# Altium schematic sheet RFFE_Controller.SchDoc
size A3
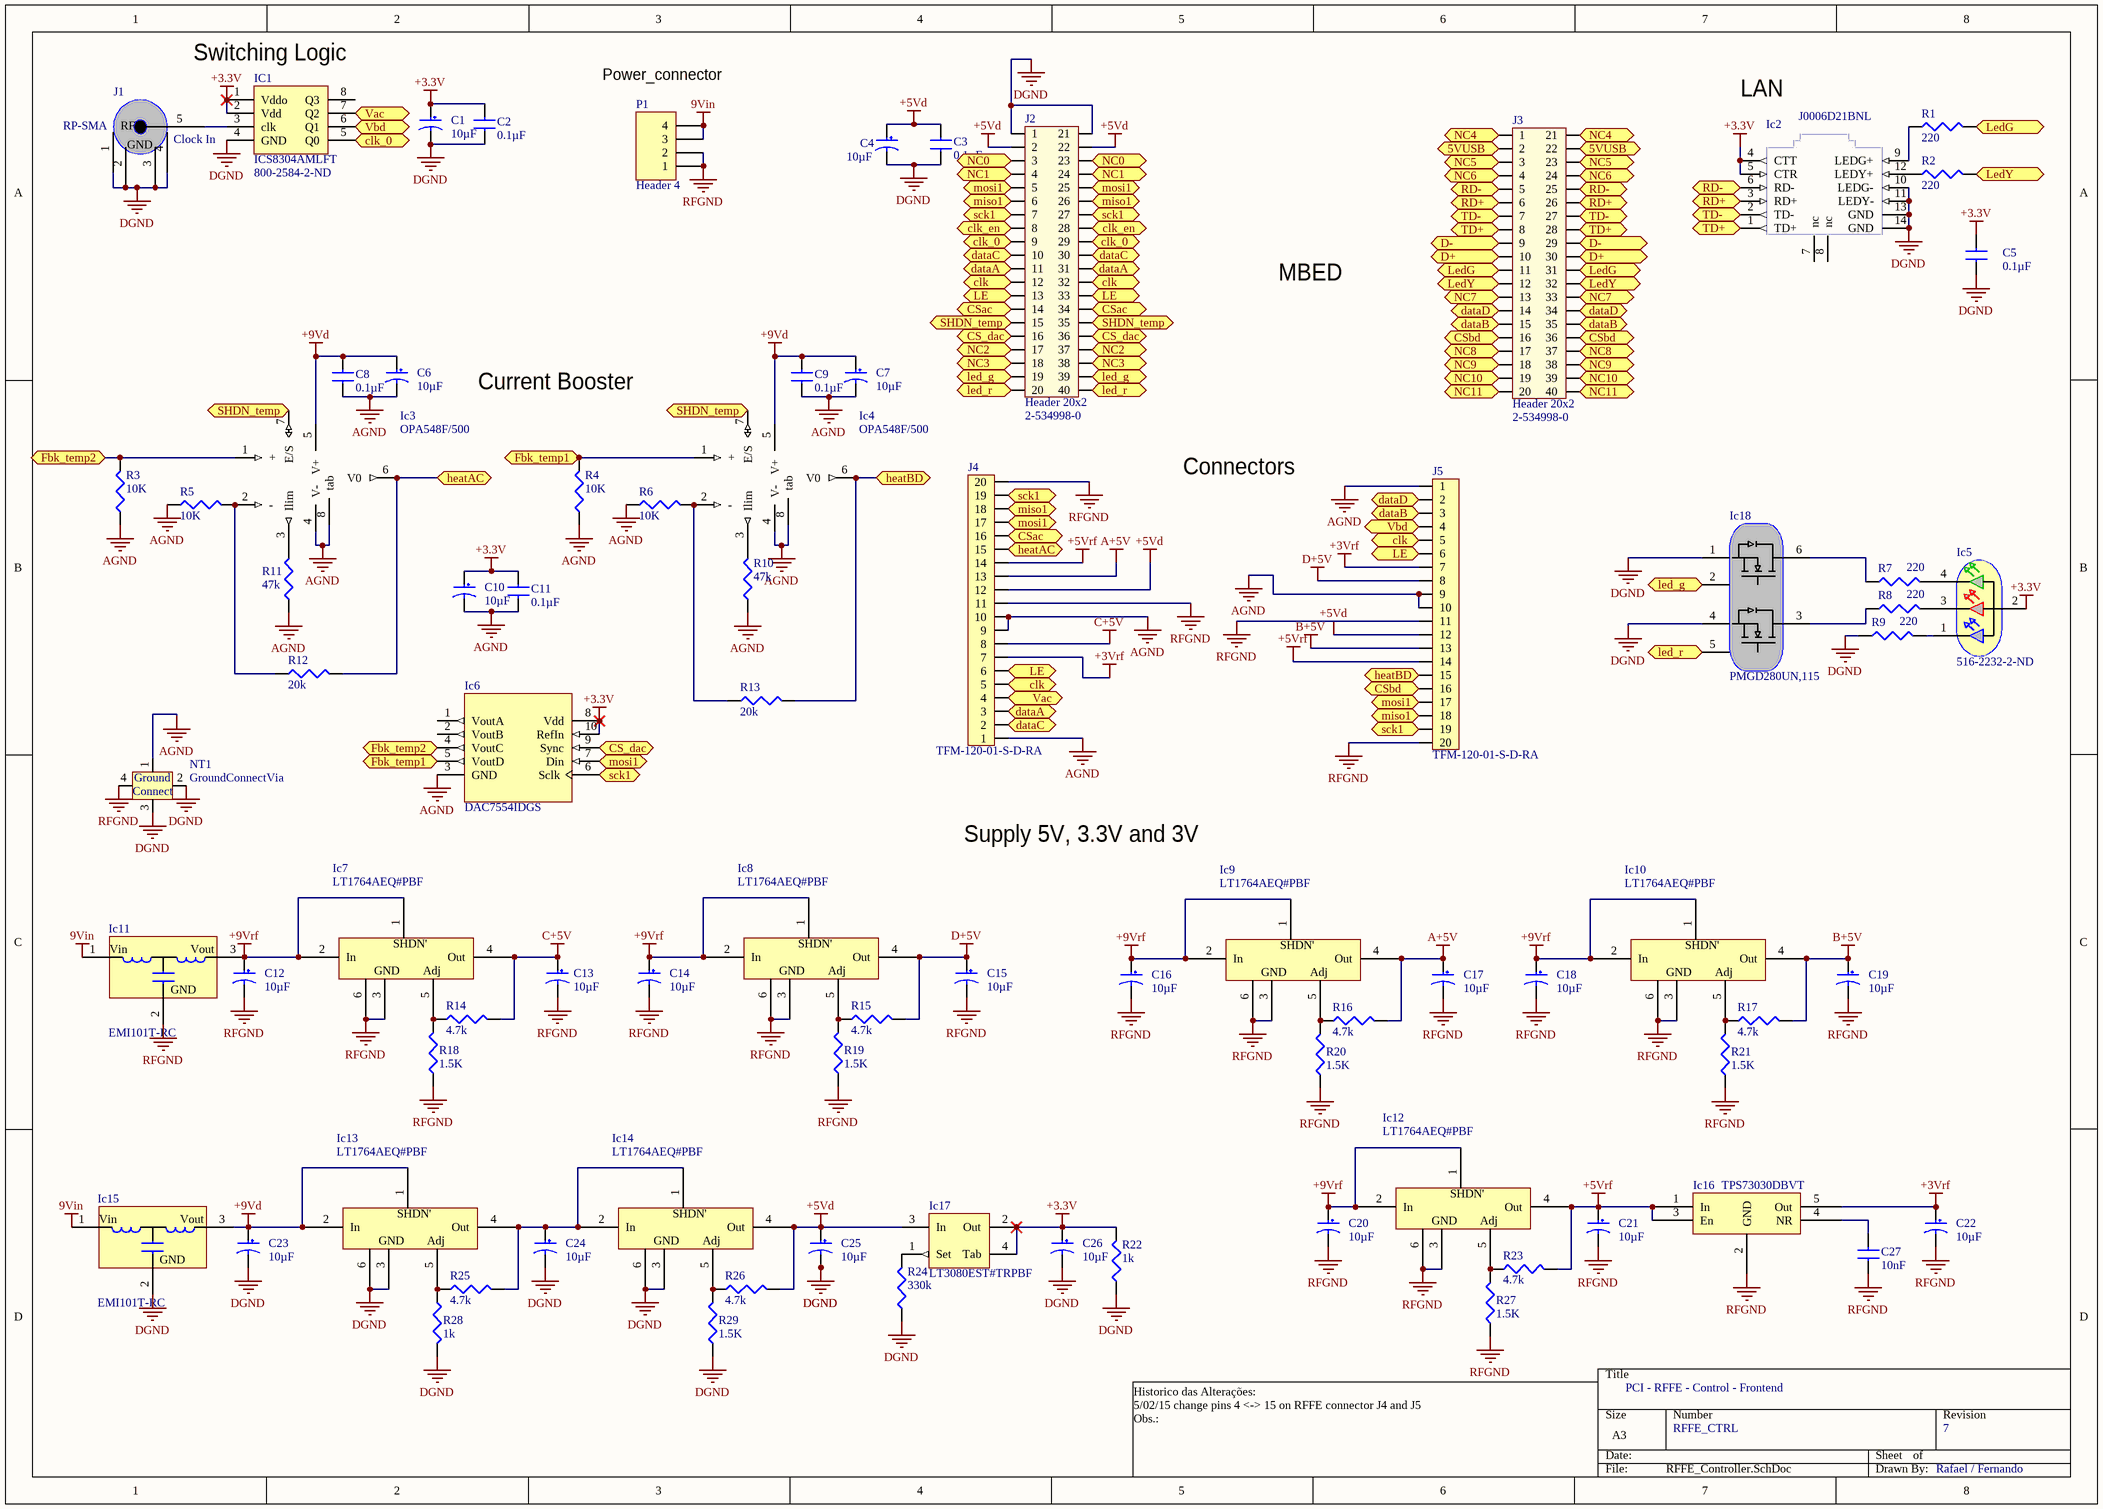
[diagram p0: RFFE_Controller.SchDoc]

## Parts
C1  Capacitance: 10µF  [1206]  (hidden comment: TPSA106K010R0900)
C2  Capacitance: 0.1µF  [0603]  (hidden comment: C1608X7R1E104K080AA)
C3  Capacitance: 0.1µF  [0603]  (hidden comment: C1608X7R1E104K080AA)
C4  Capacitance: 10µF  [1206]  (hidden comment: TPSA106K010R0900)
C5  Capacitance: 0.1µF  [0603]  (hidden comment: C1608X7R1E104K080AA)
C6  Capacitance: 10µF  [1206]  (hidden comment: TPSA106K010R0900)
C7  Capacitance: 10µF  [1206]  (hidden comment: TPSA106K010R0900)
C8  Capacitance: 0.1µF  [0603]  (hidden comment: C1608X7R1E104K080AA)
C9  Capacitance: 0.1µF  [0603]  (hidden comment: C1608X7R1E104K080AA)
C10  Capacitance: 10µF  [1206]  (hidden comment: TPSA106K010R0900)
C11  Capacitance: 0.1µF  [0603]  (hidden comment: C1608X7R1E104K080AA)
C12  Capacitance: 10µF  [1206]  (hidden comment: TPSA106K010R0900)
C13  Capacitance: 10µF  [0603]  (hidden comment: TPSA106K010R0900)
C14  Capacitance: 10µF  [1206]  (hidden comment: TPSA106K010R0900)
C15  Capacitance: 10µF  [0603]  (hidden comment: TPSA106K010R0900)
C16  Capacitance: 10µF  [1206]  (hidden comment: TPSA106K010R0900)
C17  Capacitance: 10µF  [0603]  (hidden comment: TPSA106K010R0900)
C18  Capacitance: 10µF  [1206]  (hidden comment: TPSA106K010R0900)
C19  Capacitance: 10µF  [0603]  (hidden comment: TPSA106K010R0900)
C20  Capacitance: 10µF  [1206]  (hidden comment: TPSA106K010R0900)
C21  Capacitance: 10µF  [0603]  (hidden comment: TPSA106K010R0900)
C22  Capacitance: 10µF  [TC3528-1411]  (hidden comment: CAP TANT 10UF)
C23  Capacitance: 10µF  [1206]  (hidden comment: TPSA106K010R0900)
C24  Capacitance: 10µF  [0603]  (hidden comment: TPSA106K010R0900)
C25  Capacitance: 10µF  [0603]  (hidden comment: TPSA106K010R0900)
C26  Capacitance: 10µF  [0603]  (hidden comment: TPSA106K010R0900)
C27  Capacitance: 10nF  [CAPC2012M]  (hidden comment: CAP CER 10000PF)
IC1  ICS8304AMLFT  Supplier Part Number 1: 800-2584-2-ND  [8-SOIC]
Ic2  J0006D21BNL  [RJ_45]
Ic3  Supplier Part Number 1: OPA548F/500  [DDPAK]  (hidden comment: OPA548FKTWT)
Ic4  Supplier Part Number 1: OPA548F/500  [DDPAK]  (hidden comment: OPA548FKTWT)
Ic5  Supplier Part Number 1: 516-2232-2-ND  [LED_3colors]  (hidden comment: HSMF-C113)
Ic6  DAC7554IDGS  [10-MSOP]
Ic7  IC LDO LO NOISE 3A ADJ DDPAK-5  [DD Pak]  (value not drawn)
Ic8  IC LDO LO NOISE 3A ADJ DDPAK-5  [DD Pak]  (value not drawn)
Ic9  IC LDO LO NOISE 3A ADJ DDPAK-5  [DD Pak]  (value not drawn)
Ic10  IC LDO LO NOISE 3A ADJ DDPAK-5  [DD Pak]  (value not drawn)
Ic11  EMI101T-RC  [Radial-3]
Ic12  IC LDO LO NOISE 3A ADJ DDPAK-5  [DD Pak]  (value not drawn)
Ic13  IC LDO LO NOISE 3A ADJ DDPAK-5  [DD Pak]  (value not drawn)
Ic14  IC LDO LO NOISE 3A ADJ DDPAK-5  [DD Pak]  (value not drawn)
Ic15  EMI101T-RC  [Radial-3]
Ic16  TPS73030DBVT  [DBV005]
Ic17  LT3080  [SOT-223]  (value not drawn)
Ic18  PMGD280UN,115  [SOT_363]
J1  Connector Style: RP-SMA  [SMAedge50R]  (hidden comment: CONN SMA)
J2  Header 20x2  [2-534998-0]
J3  Header 20x2  [2-534998-0]
J4  TFM-120-01-S-D-RA  [TFM-120-01-L-D]
J5  TFM-120-01-S-D-RA  [TFM-120-01-L-D]
NT1  GroundConnectVia  [GroundConnect]  (net tie, no BOM)
P1  Header 4  [HDR1X4]
R1  Resistance (Ohms): 220  [0603]  (hidden comment: ERJ-3GEYJ221V)
R2  Resistance (Ohms): 220  [0603]  (hidden comment: ERJ-3GEYJ221V)
R3  Resistance (Ohms): 10K  [RESC2012M]  (hidden comment: RES 10.0K)
R4  Resistance (Ohms): 10K  [RESC2012M]  (hidden comment: RES 10.0K)
R5  Resistance (Ohms): 10K  [RESC2012M]  (hidden comment: RES 10.0K)
R6  Resistance (Ohms): 10K  [RESC2012M]  (hidden comment: RES 10.0K)
R7  Resistance (Ohms): 220  [0603]  (hidden comment: ERJ-3GEYJ221V)
R8  Resistance (Ohms): 220  [0603]  (hidden comment: ERJ-3GEYJ221V)
R9  Resistance (Ohms): 220  [0603]  (hidden comment: ERJ-3GEYJ221V)
R10  Resistance (Ohms): 47k  [0603]  (hidden comment: ERJ-3GEYJ473V)
R11  Resistance (Ohms): 47k  [0603]  (hidden comment: ERJ-3GEYJ473V)
R12  20k  [0603]
R13  20k  [0603]
R14  Resistance (Ohms): 4.7k  [0603]  (hidden comment: ERJ-3GEYJ472V)
R15  Resistance (Ohms): 4.7k  [0603]  (hidden comment: ERJ-3GEYJ472V)
R16  Resistance (Ohms): 4.7k  [0603]  (hidden comment: ERJ-3GEYJ472V)
R17  Resistance (Ohms): 4.7k  [0603]  (hidden comment: ERJ-3GEYJ472V)
R18  Resistance (Ohms): 1.5K  [RESC2012M]  (hidden comment: RES 1.5K)
R19  Resistance (Ohms): 1.5K  [RESC2012M]  (hidden comment: RES 1.5K)
R20  Resistance (Ohms): 1.5K  [RESC2012M]  (hidden comment: RES 1.5K)
R21  Resistance (Ohms): 1.5K  [RESC2012M]  (hidden comment: RES 1.5K)
R22  Resistance (Ohms): 1k  [0603]  (hidden comment: ERJ-3EKF1001V)
R23  Resistance (Ohms): 4.7k  [0603]  (hidden comment: ERJ-3GEYJ472V)
R24  Resistance (Ohms): 330k  [0603]  (hidden comment: ERJ-3GEYJ334V)
R25  Resistance (Ohms): 4.7k  [0603]  (hidden comment: ERJ-3GEYJ472V)
R26  Resistance (Ohms): 4.7k  [0603]  (hidden comment: ERJ-3GEYJ472V)
R27  Resistance (Ohms): 1.5K  [RESC2012M]  (hidden comment: RES 1.5K)
R28  Resistance (Ohms): 1k  [0603]  (hidden comment: ERJ-3EKF1001V)
R29  Resistance (Ohms): 1.5K  [RESC2012M]  (hidden comment: RES 1.5K)

## Ports
5VUSB, clk, clk_0, clk_0 (out), clk_en, CS_dac (in), CS_dac (out), CSac, CSac (out), CSbd, CSbd (out), D+ (bidir), D- (bidir), dataA, dataB, dataC, dataD, Fbk_temp1, Fbk_temp2, heatAC, heatBD, LE, led_g (out), led_r (out), LedG, LedG (out), LedY, LedY (out), miso1, miso1 (out), mosi1, mosi1 (out), NC0 (out), NC1 (out), NC2 (out), NC3 (out), NC4 (out), NC5 (out), NC6 (out), NC7 (out), NC8 (out), NC9 (out), NC10 (out), NC11 (out), RD+, RD-, sck1, sck1 (out), SHDN_temp, TD+, TD-, Vac, Vac (out), Vbd, Vbd (out)

## Nets
9Vin: Ic11.1(Vin) Ic15.1(Vin) P1.3 P1.4
+3.3V: C1.1 C2.1 C5.1 C10.1 C11.1 C26.1 IC1.1(Vddo) IC1.2(Vdd) Ic2.4(CTT) Ic2.5(CTR) Ic5.2 Ic6.8(Vdd) Ic6.10(RefIn) Ic17.2(Out) Ic17.4(Tab) R22.1
+3Vrf: C22.1 Ic16.5(Out) J4.7 J5.7
+5Vd: C3.1 C4.1 C25.1 Ic14.4(Out) Ic17.3(In) J2.2 J2.22 J4.12 J5.12 R26.1
+5Vrf: C21.1 Ic12.4(Out) Ic16.1(In) Ic16.3(En) J4.14 J5.14 R23.1
+9Vd: C6.1 C7.1 C8.1 C9.1 C23.1 Ic3.5(V+) Ic4.5(V+) Ic13.1(SHDN) Ic13.2(In) Ic15.3(Vout)
+9Vrf: C12.1 C14.1 C16.1 C18.1 C20.1 Ic7.1(SHDN) Ic7.2(In) Ic8.1(SHDN) Ic8.2(In) Ic9.1(SHDN) Ic9.2(In) Ic10.1(SHDN) Ic10.2(In) Ic11.3(Vout) Ic12.1(SHDN) Ic12.2(In)
A+5V: C17.1 Ic9.4(Out) J4.13 R16.1
AGND: C6.2 C7.2 C8.2 C9.2 C10.2 C11.2 Ic3.4(V-) Ic3.8(tab) Ic4.4(V-) Ic4.8(tab) Ic6.3(GND) J4.1 J4.9 J4.10 J5.1 J5.9 J5.10 NT1.1 R3.2 R4.2 R5.2 R6.2 R10.2 R11.2
B+5V: C19.1 Ic10.4(Out) J5.13 R17.1
C+5V: C13.1 Ic7.4(Out) J4.8 R14.1
D+5V: C15.1 Ic8.4(Out) J5.8 R15.1
DGND: C1.2 C2.2 C3.2 C4.2 C5.2 C23.2 C24.2 C25.2 C26.2 IC1.4(GND) Ic2.10(LEDG-) Ic2.11(LEDY-) Ic2.13(GND) Ic2.14(GND) Ic13.3(GND) Ic13.6(GND) Ic14.3(GND) Ic14.6(GND) Ic15.2(GND) Ic18.1(S1) Ic18.4(S2) J1.1(GND) J1.2(GND) J1.3(GND) J1.4(GND) J2.1 J2.21 NT1.2 NT1.3 R9.2 R22.2 R24.2 R28.1 R29.2
RFGND: C12.2 C13.2 C14.2 C15.2 C16.2 C17.2 C18.2 C19.2 C20.2 C21.2 C22.2 C27.2 Ic7.3(GND) Ic7.6(GND) Ic8.3(GND) Ic8.6(GND) Ic9.3(GND) Ic9.6(GND) Ic10.3(GND) Ic10.6(GND) Ic11.2(GND) Ic12.3(GND) Ic12.6(GND) Ic16.2(GND) J4.11 J4.20 J5.11 J5.20 NT1.4 P1.1 P1.2 R18.2 R19.2 R20.2 R21.2 R27.2
5VUSB: J3.2 J3.22 ; port 5VUSB
clk: J2.12 J2.32 J4.5 J5.5 ; port clk
clk_0: IC1.5(Q0) J2.9 J2.29 ; port clk_0
clk_en: J2.8 J2.28 ; port clk_en
CS_dac: Ic6.9(Sync) J2.16 J2.36 ; port CS_dac
CSac: J2.14 J2.34 J4.16 ; port CSac
CSbd: J3.16 J3.36 J5.16 ; port CSbd
D+: J3.10 J3.30 ; port D+
D-: J3.9 J3.29 ; port D-
dataA: J2.11 J2.31 J4.3 ; port dataA
dataB: J3.15 J3.35 J5.3 ; port dataB
dataC: J2.10 J2.30 J4.2 ; port dataC
dataD: J3.14 J3.34 J5.2 ; port dataD
Fbk_temp1: Ic4.1(+) Ic6.5(VoutD) R4.1 ; port Fbk_temp1
Fbk_temp2: Ic3.1(+) Ic6.4(VoutC) R3.1 ; port Fbk_temp2
heatAC: Ic3.6(V0) J4.15 R12.1 ; port heatAC
heatBD: Ic4.6(V0) J5.15 R13.1 ; port heatBD
LE: J2.13 J2.33 J4.6 J5.6 ; port LE
led_g: Ic18.2(G1) J2.19 J2.39 ; port led_g
led_r: Ic18.5(G2) J2.20 J2.40 ; port led_r
LedG: J3.11 J3.31 R1.1 ; port LedG
LedY: J3.12 J3.32 R2.1 ; port LedY
miso1: J2.6 J2.26 J4.18 J5.18 ; port miso1
mosi1: Ic6.7(Din) J2.5 J2.25 J4.17 J5.17 ; port mosi1
NC0: J2.3 J2.23 ; port NC0
NC1: J2.4 J2.24 ; port NC1
NC2: J2.17 J2.37 ; port NC2
NC3: J2.18 J2.38 ; port NC3
NC4: J3.1 J3.21 ; port NC4
NC5: J3.3 J3.23 ; port NC5
NC6: J3.4 J3.24 ; port NC6
NC7: J3.13 J3.33 ; port NC7
NC8: J3.17 J3.37 ; port NC8
NC9: J3.18 J3.38 ; port NC9
NC10: J3.19 J3.39 ; port NC10
NC11: J3.20 J3.40 ; port NC11
RD+: Ic2.3(RD+) J3.6 J3.26 ; port RD+
RD-: Ic2.6(RD-) J3.5 J3.25 ; port RD-
sck1: Ic6.6(Sclk) J2.7 J2.27 J4.19 J5.19 ; port sck1
SHDN_temp: Ic3.7(E/S) Ic4.7(E/S) J2.15 J2.35 ; port SHDN_temp
TD+: Ic2.1(TD+) J3.8 J3.28 ; port TD+
TD-: Ic2.2(TD-) J3.7 J3.27 ; port TD-
Vac: IC1.7(Q2) J4.4 ; port Vac
Vbd: IC1.6(Q1) J5.4 ; port Vbd
NetC24_1: C24.1 Ic13.4(Out) Ic14.1(SHDN) Ic14.2(In) R25.1
NetC27_1: C27.1 Ic16.4(NR)
NetIC1_3: IC1.3(clk) J1.5(RFin)
NetIc2_9: Ic2.9(LEDG+) R1.2
NetIc2_12: Ic2.12(LEDY+) R2.2
NetIc3_2: Ic3.2(-) R5.1 R12.2
NetIc3_3: Ic3.3(Ilim) R11.1
NetIc4_2: Ic4.2(-) R6.1 R13.2
NetIc4_3: Ic4.3(Ilim) R10.1
NetIc5_1: Ic5.1 R9.1
NetIc5_3: Ic5.3 R8.1
NetIc5_4: Ic5.4 R7.1
NetIc7_5: Ic7.5(Adj) R14.2 R18.1
NetIc8_5: Ic8.5(Adj) R15.2 R19.1
NetIc9_5: Ic9.5(Adj) R16.2 R20.1
NetIc10_5: Ic10.5(Adj) R17.2 R21.1
NetIc12_5: Ic12.5(Adj) R23.2 R27.1
NetIc13_5: Ic13.5(Adj) R25.2 R28.2
NetIc14_5: Ic14.5(Adj) R26.2 R29.1
NetIc17_1: Ic17.1(Set) R24.1
NetIc18_3: Ic18.3(D2) R8.2
NetIc18_6: Ic18.6(D1) R7.2

Not connected (* = marked no-connect by the designer): IC1 8(Q3); Ic2 7(nc) 8(nc); Ic6 1(VoutA) 2(VoutB)

## Notes on the sheet
- (near IC1) Switching Logic
- (near P1) Power_connector
- LAN
- (near J1) Clock In
- MBED
- Current Booster
- Connectors
- Supply 5V, 3.3V and 3V
- PCI - RFFE - Control - Frontend
- RFFE_CTRL
- 7
- Historico das Alterações:
  5/02/15 change pins 4 <-> 15 on RFFE connector J4 and J5
  Obs.:
- Rafael / Fernando
- (in symbol 132289RP) RF
- (in symbol GroundConnectVia) Ground; Connect
- (in symbol LT1764AEQ#PBF) SHDN'

## Library data of the parts
C1 C4 C6 C7 C10 C12-C21 C23-C26 = TPSA106K010R0900: CAP TANT 10UF 10V 10% 1206; Manufacturer: AVX Corporation; Manufacturer Size Code: A; ESR (Equivalent Series Resistance): 900 mOhm; Type: Molded; Supplier 1: Digi-Key; Manufacturer Part Number: TPSA106K010R0900; RoHS: RoHS Compliant; Category: Capacitors; Stock 1: 24588; Pricing 1: 1=0.77, 10=0.737, 100=0.3575, 250=0.297, 500=0.2695, 1000=0.2475 (USD); Packaging: Cut Tape (CT); Voltage - Rated: 10V; Tolerance: ±10%; Operating Temperature: -55°C ~ 125°C; Mounting Type: Surface Mount; Package / Case: 1206 (3216 Metric); Size / Dimension: 0.126" L x 0.063" W (3.20mm x 1.60mm); Height - Seated (Max): 0.071" (1.80mm); Lead Spacing: -; Features: General Purpose; Lifetime @ Temp.: -; ComponentLink1URL: http://www.avx.com/docs/Catalogs/tps.pdf; ComponentLink1Description: http://www.avx.com/docs/Catalogs/tps.pdf; Supplier Part Number 1: 478-1751-1-ND
C2 C3 C5 C8 C9 C11 = C1608X7R1E104K080AA: CAP CER 0.1UF 25V 10% X7R 0603; Manufacturer: TDK Corporation; Supplier 1: Digi-Key; Manufacturer Part Number: C1608X7R1E104K080AA; RoHS: RoHS Compliant; Category: Capacitors; Stock 1: 128000; Pricing 1: 4000=0.0046, 8000=0.0042, 12000=0.004, 28000=0.0038, 100000=0.00275 (USD); Packaging: Tape & Reel (TR); Voltage - Rated: 25V; Tolerance: ±10%; Temperature Coefficient: X7R; Mounting Type: Surface Mount, MLCC; Operating Temperature: -55°C ~ 125°C; Applications: General Purpose; Ratings: -; Package / Case: 0603 (1608 Metric); Size / Dimension: 0.063" L x 0.031" W (1.60mm x 0.80mm); Height - Seated (Max): -; Thickness (Max): 0.037" (0.95mm); Lead Spacing: -; Features: -; Lead Style: -; ComponentLink1URL: http://product.tdk.com/capacitor/mlcc/en/documents/mlcc_commercial_general_en.pdf; ComponentLink1Description: http://product.tdk.com/capacitor/mlcc/en/documents/mlcc_commercial_general_en.pdf; Supplier Part Number 1: 445-1316-2-ND
C22 = T520B106M016ATE100: CAP TANT 10UF 16V 20% 1411; Manufacturer: Kemet; Manufacturer Size Code: B; ESR (Equivalent Series Resistance): 100.0 mOhm; Type: Molded; Supplier 1: Digi-Key; Manufacturer Part Number: T520B106M016ATE100; RoHS: RoHS Compliant; Category: Capacitors; Stock 1: 209; Pricing 1: 1=1.5, 10=1.23, 25=1.11, 100=0.99, 250=0.87, 500=0.81, 1000=0.63 (USD); Voltage - Rated: 16V; Tolerance: ±20%; Operating Temperature: -55°C ~ 105°C; Mounting Type: Surface Mount; Package / Case: 1411 (3528 Metric); Size / Dimension: 0.138" L x 0.110" W (3.50mm x 2.80mm); Height - Seated (Max): 0.083" (2.10mm); Lead Spacing: -; Features: Polymer; Packaging: Cut Tape (CT); Lifetime @ Temp.: -; ComponentLink1URL: http://www.kemet.com/datasheets&T520B106M016ATE100; ComponentLink1Description: http://www.kemet.com/datasheets&T520B106M016ATE100; Supplier Part Number 1: 399-5483-1-ND
C27 = C2012C0G1H103J/0.60: CAP CER 10000PF 50V 5% NP0 0805; Manufacturer: TDK Corporation; Temperature Coefficient: C0G, NP0; Supplier 1: Digi-Key; Manufacturer Part Number: C2012C0G1H103J/0.60; RoHS: RoHS Compliant; Category: Capacitors; Stock 1: 7053; Pricing 1: 1=0.46, 10=0.363, 100=0.1898, 250=0.14024, 500=0.1089, 1000=0.0858 (USD); Voltage - Rated: 50V; Tolerance: ±5%; Mounting Type: Surface Mount, MLCC; Operating Temperature: -55°C ~ 125°C; Applications: General Purpose; Ratings: -; Package / Case: 0805 (2012 Metric); Size / Dimension: 0.079" L x 0.049" W (2.00mm x 1.25mm); Height - Seated (Max): -; Thickness (Max): 0.028" (0.70mm); Lead Spacing: -; Features: -; Packaging: Cut Tape (CT); Lead Style: -; ComponentLink1URL: http://www.tdk.com/pdf/general_B11.pdf; ComponentLink1Description: http://www.tdk.com/pdf/general_B11.pdf; Supplier Part Number 1: 445-7519-1-ND
IC1 = ICS8304AMLFT: IC CLK BUFFER 1:4 200MHZ 8SOIC; Manufacturer: IDT, Integrated Device Technology Inc; Number of Circuits: 1; Differential - Input:Output: No/No; Input: LVCMOS, LVTTL; Voltage - Supply: 3.135 V ~ 3.465 V; Supplier 1: Digi-Key; Manufacturer Part Number: ICS8304AMLFT; RoHS: RoHS Compliant; Category: Integrated Circuits (ICs); Stock 1: 2500; Pricing 1: 2500=6.50278, 5000=6.29957, 12500=6.09636 (USD); Packaging: Tape & Reel (TR); Type: Fanout Buffer (Distribution); Ratio - Input:Output: 1:4; Output: LVCMOS, LVTTL; Frequency - Max: 200MHz; Operating Temperature: 0°C ~ 70°C; Mounting Type: Surface Mount; Package / Case: 8-SOIC (0.154", 3.90mm Width); Supplier Device Package: 8-SOIC; ComponentLink1URL: http://www.idt.com/document/8304-datasheet-0; ComponentLink1Description: http://www.idt.com/document/8304-datasheet-0
Ic2 = J0006D21BNL: CONN MAGJACK 1PORT 100 BASE-TX; Manufacturer: Pulse Electronics Corporation; Connector Type: RJ45; Number of Ports: 1; LED Color: Green - Yellow; Number of Cores per Jack: 4; Shielding: Shielded; Tab Direction: Down; Shield Material: Brass; Supplier 1: Digi-Key; Manufacturer Part Number: J0006D21BNL; RoHS: RoHS Compliant; Category: Connectors, Interconnects; Stock 1: 1565; Pricing 1: 1=6.38, 25=5.586, 50=5.32, 100=5.054, 250=4.522, 500=4.256, 1000=3.724, 2500=3.5378, 5000=3.458 (USD); Packaging: Bulk; Number of Rows: 1; Applications: 10/100 Base-TX, AutoMDIX; Mounting Type: Through Hole; Orientation: 90° Angle (Right); Termination: Solder; Height Above Board: 0.545" (13.84mm); Features: Board Guide; Contact Material: Phosphor Bronze; Contact Finish: Gold; Contact Finish Thickness: 15µin (0.38µm); Housing Material: Thermoplastic; Operating Temperature: 0°C ~ 70°C; ComponentLink1URL: http://productfinder.pulseeng.com/products/datasheets/J403.pdf; ComponentLink1Description: http://productfinder.pulseeng.com/products/datasheets/J403.pdf; Supplier Part Number 1: J0006D21BNL
Ic3 Ic4 = OPA548FKTWT: IC OPAMP PWR 1MHZ SGL D2PAK-7; Manufacturer: Texas Instruments; Amplifier Type: Power; Number of Circuits: 1; Slew Rate: 10 V/µs; Current - Input Bias: 100nA; Voltage - Input Offset: 2mV; Current - Supply: 17mA; Current - Output / Channel: 5A; Voltage - Supply, Single/Dual (±): 8 V ~ 60 V, ±4 V ~ 30 V; Supplier 1: Digi-Key; Manufacturer Part Number: OPA548FKTWT; RoHS: RoHS Compliant; Category: Integrated Circuits (ICs); Stock 1: 1164; Pricing 1: 1=16.22, 10=14.721, 25=13.6488 (USD); Packaging: Digi-Reel®; Output Type: -; Gain Bandwidth Product: 1MHz; -3db Bandwidth: -; Operating Temperature: -40°C ~ 85°C; Mounting Type: Surface Mount; Package / Case: TO-263-8, D²Pak (7 Leads + Tab), TO-263CA; Supplier Device Package: DDPAK/TO-263-7; ComponentLink1URL: http://www.ti.com/lit/ds/symlink/opa548.pdf; ComponentLink1Description: http://www.ti.com/lit/ds/symlink/opa548.pdf
Ic5 = HSMF-C113: LED CHIP RGB 2.5X1.0X1.0MM SMD; Manufacturer: Avago Technologies US Inc.; Wavelength - Dominant: 626nm, 572nm, 470nm; Wavelength - Peak: 637nm, 570nm, 468nm; Millicandela Rating: 80mcd Red, 50mcd Green, 60mcd Blue; Voltage - Forward (Vf) (Typ): 1.9V Red, 2V Green, 3.4V Blue; Current - Test: 20mA; Viewing Angle: 120°, 125°, 125°; Lens Type: Diffused; Lens Style/Size: Rectangle with Domed Top, 2.1mm x 1mm; Supplier 1: Digi-Key; Manufacturer Part Number: HSMF-C113; RoHS: RoHS Compliant; Category: Optoelectronics; Stock 1: 18000; Pricing 1: 3000=0.399, 6000=0.39, 15000=0.375, 30000=0.36 (USD); Packaging: Tape & Reel (TR); Color: Red, Green, Blue (RGB); Package / Case: 4-SMD, No Lead; Size / Dimension: 2.50mm L x 1.00mm W; Height: 1.00mm; Mounting Type: Surface Mount, Right Angle; Luminous Flux @ Current - Test: -; ComponentLink1URL: http://www.avagotech.com/docs/AV02-0611EN; ComponentLink1Description: http://www.avagotech.com/docs/AV02-0611EN
Ic6 = DAC7554IDGS: IC DAC 12BIT QUAD W/SPI 10-MSOP; Manufacturer: Texas Instruments; Settling Time: 5µs; Number of Bits: 12; Data Interface: Serial, SPI™; Number of Converters: 4; Voltage Supply Source: Single Supply; Power Dissipation (Max): 3.5mW; Number of Outputs and Type: 4 Voltage, Unipolar; DAC7554: 296-17551-5-ND; Supplier 1: Digi-Key; RoHS: RoHS Compliant; Category: Integrated Circuits (ICs); Stock 1: 1057; Pricing 1: 1=11.48, 10=10.44, 100=7.047, 250=6.91652, 500=6.786, 750=6.65551, 1000=6.525 (USD); Packaging: Tube; Operating Temperature: -40°C ~ 105°C; Mounting Type: Surface Mount; Package / Case: 10-TFSOP, 10-MSOP (0.118", 3.00mm Width); Supplier Device Package: 10-MSOP; Sampling Rate (Per Second): *; ComponentLink1URL: http://www.ti.com/lit/ds/symlink/dac7554.pdf; ComponentLink1Description: http://www.ti.com/lit/ds/symlink/dac7554.pdf; Supplier 2: Farnell; Pricing: 1=12.62, 10=10.51, 100=6.88, 250=6.56, 500=6.43 (GBP); Stock: 63
Ic7-Ic10 Ic12-Ic14 = LT1764AEQ#PBF: Manufacturer: Linear Technology; Regulator Topology: Positive Adjustable; Voltage - Output: 1.21 V ~ 20 V; Voltage - Input: 2.7 V ~ 20 V; Voltage - Dropout (Typical): 0.34V @ 3A; Number of Regulators: 1; Current - Limit (Min): 3.1A; Supplier 1: Digi-Key; RoHS: RoHS Compliant; Category: Integrated Circuits (ICs); Stock 1: 4102; Pricing 1: 1=7.38, 25=5.09, 100=4.19 (USD); Current - Output: 3A; Operating Temperature: -40°C ~ 125°C; Mounting Type: Surface Mount; Package / Case: TO-263-6, D²Pak (5 Leads + Tab), TO-263BA; Supplier Device Package: D2PAK-5; Packaging: Tube; ComponentLink1URL: http://www.linear.com/docs/1316; ComponentLink1Description: http://www.linear.com/docs/1316; Supplier Part Number 1: LT1764AEQ#PBF-ND; Manufacturer Part Number: LT1764AEQ#PBF
Ic11 Ic15 = EMI101T-RC: FILTER EMI 100PF 350-500MHZ 5A; Manufacturer: Bourns Inc.; Number of Channels: 1; Attenuation Value: 25dB @ 350MHz ~ 500MHz; Resistance - Channel (Ohms): 0.05; Values: C = 100pF; ESD Protection: No; Filter Order: 3rd; Supplier 1: Digi-Key; RoHS: Vendor undefined; Category: Filters; Stock 1: 15905; Pricing 1: 1=0.27, 10=0.255, 25=0.2428, 50=0.2352, 100=0.2273, 250=0.21552, 500=0.18026, 1000=0.1399 (USD); Packaging: Cut Tape (CT); Type: Low Pass; Package / Case: Radial - 3 Leads; Size / Dimension: 0.354" L x 0.126" W (9.00mm x 3.20mm); Operating Temperature: -25°C ~ 85°C; ComponentLink1URL: http://www.bourns.com/data/global/pdfs/emi_t_series.pdf; ComponentLink1Description: http://www.bourns.com/data/global/pdfs/emi_t_series.pdf; Supplier Part Number 1: EMI_Filter; Manufacturer Part Number: EMI101T-RC; Technology: LC (T-Type); Center / Cutoff Frequency: -; Current: 5A; Applications: General Purpose; Height: 0.315" (8.00mm)
Ic16 = TPS73030DBVT: IC LDO REG HI-PSRR 3V SOT23-5; Manufacturer: Texas Instruments; Regulator Topology: Positive Fixed; Voltage - Input: Up to 5.5V; Voltage - Dropout (Typical): 0.12V @ 200mA; Number of Regulators: 1; Current - Output: 200mA (Max); Current - Limit (Min): 285mA; Supplier 1: Digi-Key; RoHS: RoHS Compliant; Category: Integrated Circuits (ICs); Stock 1: 572; Pricing 1: 1=0.84, 10=0.733, 25=0.6476, 100=0.5643 (USD); Voltage - Output: 3V; Operating Temperature: -40°C ~ 125°C; Mounting Type: Surface Mount; Package / Case: SC-74A, SOT-753; Supplier Device Package: SOT-23-5; Packaging: Cut Tape (CT); ComponentLink1URL: http://www.ti.com/lit/ds/symlink/tps73001.pdf; ComponentLink1Description: http://www.ti.com/lit/ds/symlink/tps73001.pdf; Supplier Part Number 1: 296-17579-1-ND; Manufacturer Part Number: TPS73030DBVT
Ic17 = LT3080EST#TRPBF: IC REG LDO ADJ 1.1A SOT223; Manufacturer: Linear Technology; Number of Regulators: 1; Regulator Topology: Positive Adjustable; Voltage - Input: 1.2 V ~ 36 V; Voltage - Output: Adj to 36V; Voltage - Dropout (Typical): 1.35V @ 1.1A; Supplier 1: Digi-Key; Manufacturer Part Number: LT3080EST#TRPBF; RoHS: RoHS Compliant; Category: Integrated Circuits (ICs); Stock 1: 5945; Pricing 1: 1=4.22, 25=3.7688, 100=3.3919 (USD); Packaging: Cut Tape (CT); Current - Limit (Min): 1.1A; Current - Output: 1.1A; Operating Temperature: -40°C ~ 125°C; Mounting Type: Surface Mount; Package / Case: TO-261-4, TO-261AA; Supplier Device Package: SOT-223; ComponentLink1URL: http://www.linear.com/docs/25276; ComponentLink1Description: http://www.linear.com/docs/25276; Supplier Part Number 1: LT3080EST#TRPBF
Ic18 = PMGD280UN,115: MOSFET N-CH TRENCH DL 20V 6TSSOP; Manufacturer: NXP Semiconductors; FET Type: 2 N-Channel (Dual); FET Feature: Logic Level Gate; Current - Continuous Drain (Id) @ 25°C: 870mA; Rds On (Max) @ Id, Vgs: 340 mOhm @ 200mA, 4.5V; Vgs(th) (Max) @ Id: 1V @ 250µA; Gate Charge (Qg) @ Vgs: 0.89nC @ 4.5V; Input Capacitance (Ciss) @ Vds: 45pF @ 20V; Power - Max: 400mW; Supplier 1: Digi-Key; RoHS: RoHS Compliant; Category: Discrete Semiconductor Products; Stock 1: 8125; Pricing 1: 1=0.48, 10=0.378, 25=0.3188, 100=0.2599, 250=0.21528, 500=0.17784, 1000=0.1332 (USD); Packaging: Cut Tape (CT); Drain to Source Voltage (Vdss): 20V; Mounting Type: Surface Mount; Package / Case: 6-TSSOP, SC-88, SOT-363; Supplier Device Package: 6-TSSOP; ComponentLink1URL: http://www.nxp.com/documents/data_sheet/PMGD280UN.pdf; ComponentLink1Description: http://www.nxp.com/documents/data_sheet/PMGD280UN.pdf; Supplier Part Number 1: 568-2365-1-ND; Manufacturer Part Number: PMGD280UN,115
J1 = 132289RP: CONN RCPT BLKHD SMA REV POL PCB; Manufacturer: Amphenol Connex; Connector Type: Jack, Male Pins; Contact Termination: Solder; Impedance: 50 Ohm; Frequency - Max: 18GHz; Supplier 1: Digi-Key; Manufacturer Part Number: 132289RP; RoHS: RoHS Compliant; Category: Connectors, Interconnects; Stock 1: 65; Pricing 1: 1=10.8, 10=9.99, 100=8.37, 250=7.29, 500=7.02, 1000=6.75 (USD); Mounting Type: Board Edge, End Launch; Fastening Type: Threaded; Cable Group: -; Features: -; Color: -; Packaging: Bulk; ComponentLink1URL: http://www.amphenolconnex.com/media/downloads/4145/132289rp.pdf; ComponentLink1Description: http://www.amphenolconnex.com/media/downloads/4145/132289rp.pdf; Supplier Part Number 1: ACX1427-ND
J2 J3 = Header 20x2: CONN RECEPT 40POS .100 VERT DUAL; Manufacturer: TE Connectivity; Row Spacing: 0.100" (2.54mm); Number of Positions Loaded: All; Number of Positions: 40; Connector Type: Receptacle, Bottom or Top Entry; Supplier 1: Digi-Key; Color: Black; Contact Finish Thickness: 30µin (0.76µm); Contact Finish: Gold; Features: -; Fastening Type: -; Termination: Solder; Mounting Type: Through Hole; Number of Rows: 2; Pitch: 0.100" (2.54mm); Contact Type: Female Socket; Packaging: Tube; RoHS: RoHS non-compliant; Supplier: Digi-Key; Category: Connectors, Interconnects; Pricing: 1=6.58, 10=6.302, 50=5.48, 100=5.206, 250=4.658, 500=4.384, 1000=3.836, 2500=3.6442, 5000=3.562 (USD); Supplier Part Number 1: A26498-ND; Supplier Part Number: A26498-ND; Manufacturer Part Number: 2-534998-0
J4 J5 = TFM-120-01-L-S-RA: Manufacturer: SAMTEC; Gender: Header; SVHC: No SVHC (20-Jun-2013); Pitch Spacing: 1.27; Product Range: SAMTEC - TFM Series; Contact Termination: Through Hole Right Angle; No. of Contacts: 40; No. of Rows: 2; RoHS: YES; Supplier 1: Farnell; Contact Material: Phosphor Bronze; Supplier: Farnell; Contact Plating: Gold; Pricing: 1=10.77, 10=7.4, 50=4.94, 100=4.39, 250=3.95, 500=3.49 (GBP); Stock: 100; Manufacturer Part Number: TFM-120-01-S-D-RA
P1 = Header 4: Header, 4-Pin; LatestRevisionDate: 17-Jul-2002; LatestRevisionNote: Re-released for DXP Platform.; Publisher: Altium Limited
R1 R2 R7-R9 = ERJ-3GEYJ221V: RES 220 OHM 1/10W 5% 0603 SMD; Manufacturer: Panasonic Electronic Components; Power (Watts): 0.1W, 1/10W; Temperature Coefficient: ±200ppm/°C; Supplier 1: Digi-Key; Manufacturer Part Number: ERJ-3GEYJ221V; RoHS: RoHS Compliant; Category: Resistors; Stock 1: 1000000; Pricing 1: 5000=0.00152, 10000=0.00132, 25000=0.00116, 50000=0.00106, 125000=0.00104 (USD); Packaging: Tape & Reel (TR); Composition: Thick Film; Features: -; Tolerance: ±5%; Package / Case: 0603 (1608 Metric); Supplier Device Package: 0603; Size / Dimension: 0.063" L x 0.031" W (1.60mm x 0.80mm); Height: 0.022" (0.55mm); Number of Terminations: 2; ComponentLink1URL: http://industrial.panasonic.com/www-cgi/jvcr13pz.cgi?E+PZ+3+AOA0001+ERJ3GEYJ221V+7+WW; ComponentLink1Description: http://industrial.panasonic.com/www-cgi/jvcr13pz.cgi?E+PZ+3+AOA0001+ERJ3GEYJ221V+7+WW; Supplier Part Number 1: P220GTR-ND
R3-R6 = ERJ-6ENF1002V: RES 10.0K OHM 1/8W 1% 0805 SMD; Manufacturer: Panasonic - ECG; Power (Watts): 0.125W, 1/8W; Temperature Coefficient: ±100ppm/°C; Supplier 1: Digi-Key; Manufacturer Part Number: ERJ-6ENF1002V; RoHS: RoHS Compliant; Category: Resistors; Stock 1: 3692122; Pricing 1: 1=0.07, 50=0.0276, 100=0.021, 250=0.0156, 500=0.01152, 1000=0.00768 (USD); Composition: Thick Film; Features: -; Tolerance: ±1%; Package / Case: 0805 (2012 Metric); Size / Dimension: 0.079" L x 0.049" W (2.00mm x 1.25mm); Height: 0.028" (0.70mm); Number of Terminations: 2; Packaging: Cut Tape (CT); ComponentLink1URL: http://industrial.panasonic.com/www-cgi/jvcr13pz.cgi?E+PZ+3+AOA0002+ERJ6ENF1002V+7+WW; ComponentLink1Description: http://industrial.panasonic.com/www-cgi/jvcr13pz.cgi?E+PZ+3+AOA0002+ERJ6ENF1002V+7+WW; Supplier Part Number 1: P10.0KCCT-ND
R10 R11 = ERJ-3GEYJ473V: RES 47K OHM 1/10W 5% 0603 SMD; Manufacturer: Panasonic Electronic Components; Power (Watts): 0.1W, 1/10W; Temperature Coefficient: ±200ppm/°C; Supplier 1: Digi-Key; RoHS: RoHS Compliant; Category: Resistors; Stock 1: 1245000; Pricing 1: 5000=0.00152, 10000=0.00132, 25000=0.00116, 50000=0.00106, 125000=0.00104 (USD); Packaging: Tape & Reel (TR); Composition: Thick Film; Features: -; Tolerance: ±5%; Package / Case: 0603 (1608 Metric); Supplier Device Package: 0603; Size / Dimension: 0.063" L x 0.031" W (1.60mm x 0.80mm); Height: 0.022" (0.55mm); Number of Terminations: 2; ComponentLink1URL: http://industrial.panasonic.com/www-cgi/jvcr13pz.cgi?E+PZ+3+AOA0001+ERJ3GEYJ473V+7+WW; ComponentLink1Description: http://industrial.panasonic.com/www-cgi/jvcr13pz.cgi?E+PZ+3+AOA0001+ERJ3GEYJ473V+7+WW; Supplier Part Number 1: P47KGTR-ND; Manufacturer Part Number: ERJ-3GEYJ473V
R12 R13 = ERJ-3GEYJ203V: RES 20K OHM 1/10W 5% 0603 SMD; Manufacturer: Panasonic Electronic Components; Power (Watts): 0.1W, 1/10W; Temperature Coefficient: ±200ppm/°C; Supplier 1: Digi-Key; Manufacturer Part Number: ERJ-3GEYJ203V; RoHS: RoHS Compliant; Category: Resistors; Stock 1: 159574; Pricing 1: 1=0.1, 50=0.0092, 100=0.007, 250=0.0052, 500=0.00384, 1000=0.00256 (USD); Packaging: Digi-Reel®; Composition: Thick Film; Features: -; Tolerance: ±5%; Package / Case: 0603 (1608 Metric); Supplier Device Package: 0603; Size / Dimension: 0.063" L x 0.031" W (1.60mm x 0.80mm); Height: 0.022" (0.55mm); Number of Terminations: 2; ComponentLink1URL: http://industrial.panasonic.com/www-cgi/jvcr13pz.cgi?E+PZ+3+AOA0001+ERJ3GEYJ203V+7+WW; ComponentLink1Description: http://industrial.panasonic.com/www-cgi/jvcr13pz.cgi?E+PZ+3+AOA0001+ERJ3GEYJ203V+7+WW; Supplier Part Number 1: P20KGTR-ND; Resistance (Ohms): 20k
R14-R17 R23 R25 R26 = ERJ-3GEYJ472V: RES 4.7K OHM 1/10W 5% 0603 SMD; Manufacturer: Panasonic Electronic Components; Power (Watts): 0.1W, 1/10W; Temperature Coefficient: ±200ppm/°C; Supplier 1: Digi-Key; Manufacturer Part Number: ERJ-3GEYJ472V; RoHS: RoHS Compliant; Category: Resistors; Stock 1: 3410000; Pricing 1: 5000=0.00152, 10000=0.00132, 25000=0.00116, 50000=0.00106, 125000=0.00104 (USD); Packaging: Tape & Reel (TR); Composition: Thick Film; Features: -; Tolerance: ±5%; Package / Case: 0603 (1608 Metric); Supplier Device Package: 0603; Size / Dimension: 0.063" L x 0.031" W (1.60mm x 0.80mm); Height: 0.022" (0.55mm); Number of Terminations: 2; ComponentLink1URL: http://industrial.panasonic.com/www-cgi/jvcr13pz.cgi?E+PZ+3+AOA0001+ERJ3GEYJ472V+7+WW; ComponentLink1Description: http://industrial.panasonic.com/www-cgi/jvcr13pz.cgi?E+PZ+3+AOA0001+ERJ3GEYJ472V+7+WW; Supplier Part Number 1: P4.7KGTR-ND
R18-R21 R27 R29 = ERA-6AEB152V: RES 1.5K OHM 1/8W .1% 0805 SMD; Manufacturer: Panasonic - ECG; Power (Watts): 0.125W, 1/8W; Temperature Coefficient: ±25ppm/°C; Tolerance: ±0.1%; Supplier 1: Digi-Key; Manufacturer Part Number: ERA-6AEB152V; RoHS: RoHS Compliant; Category: Resistors; Stock 1: 52069; Pricing 1: 1=0.51, 50=0.1996, 100=0.1603, 250=0.12468, 500=0.09406, 1000=0.07268 (USD); Composition: Thin Film; Features: -; Package / Case: 0805 (2012 Metric); Size / Dimension: 0.079" L x 0.049" W (2.00mm x 1.25mm); Height: 0.024" (0.60mm); Number of Terminations: 2; Packaging: Cut Tape (CT); ComponentLink1URL: http://industrial.panasonic.com/www-cgi/jvcr13pz.cgi?E+PZ+3+AOA0026+ERA6AEB152V+7+WW; ComponentLink1Description: http://industrial.panasonic.com/www-cgi/jvcr13pz.cgi?E+PZ+3+AOA0026+ERA6AEB152V+7+WW; Supplier Part Number 1: P1.5KDACT-ND
R22 R28 = ERJ-3EKF1001V: RES 1K OHM 1/10W 1% 0603 SMD; Manufacturer: Panasonic Electronic Components; Power (Watts): 0.1W, 1/10W; Temperature Coefficient: ±100ppm/°C; Supplier 1: Digi-Key; Manufacturer Part Number: ERJ-3EKF1001V; RoHS: RoHS Compliant; Category: Resistors; Stock 1: 6710000; Pricing 1: 5000=0.00228, 10000=0.00198, 25000=0.00174, 50000=0.0016, 125000=0.00156 (USD); Packaging: Tape & Reel (TR); Composition: Thick Film; Features: -; Tolerance: ±1%; Package / Case: 0603 (1608 Metric); Supplier Device Package: 0603; Size / Dimension: 0.063" L x 0.031" W (1.60mm x 0.80mm); Height: 0.022" (0.55mm); Number of Terminations: 2; ComponentLink1URL: http://industrial.panasonic.com/www-cgi/jvcr13pz.cgi?E+PZ+3+AOA0002+ERJ3EKF1001V+7+WW; ComponentLink1Description: http://industrial.panasonic.com/www-cgi/jvcr13pz.cgi?E+PZ+3+AOA0002+ERJ3EKF1001V+7+WW; Supplier Part Number 1: P1.00KHTR-ND
R24 = ERJ-3GEYJ334V: RES 330K OHM 1/10W 5% 0603 SMD; Manufacturer: Panasonic Electronic Components; Power (Watts): 0.1W, 1/10W; Temperature Coefficient: ±200ppm/°C; Supplier 1: Digi-Key; Manufacturer Part Number: ERJ-3GEYJ334V; RoHS: RoHS Compliant; Category: Resistors; Stock 1: 335000; Pricing 1: 5000=0.00152, 10000=0.00132, 25000=0.00116, 50000=0.00106, 125000=0.00104 (USD); Packaging: Tape & Reel (TR); Composition: Thick Film; Features: -; Tolerance: ±5%; Package / Case: 0603 (1608 Metric); Supplier Device Package: 0603; Size / Dimension: 0.063" L x 0.031" W (1.60mm x 0.80mm); Height: 0.022" (0.55mm); Number of Terminations: 2; ComponentLink1URL: http://industrial.panasonic.com/www-cgi/jvcr13pz.cgi?E+PZ+3+AOA0001+ERJ3GEYJ334V+7+WW; ComponentLink1Description: http://industrial.panasonic.com/www-cgi/jvcr13pz.cgi?E+PZ+3+AOA0001+ERJ3GEYJ334V+7+WW; Supplier Part Number 1: P330KGTR-ND